# Altium project CB_REV_C.PrjPcb
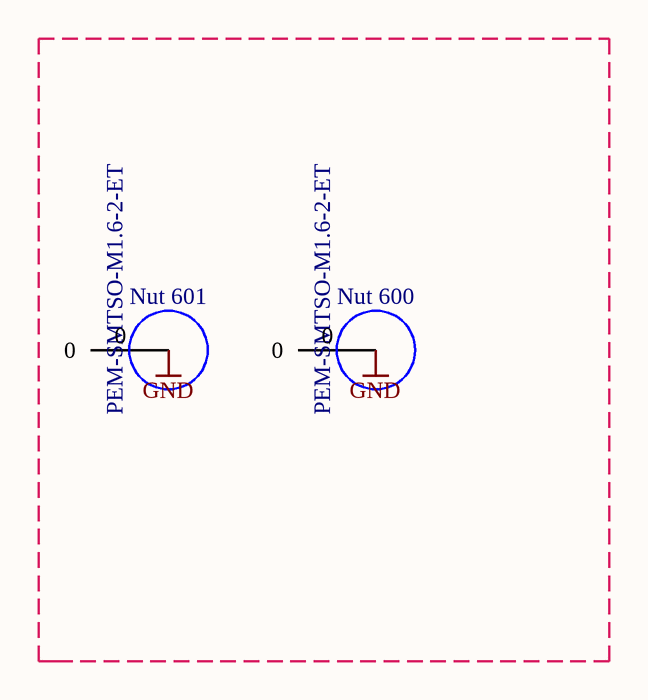
[diagram p0: FULL_CB_INTEL_REV_C.SchDoc]
4 sheets, 21 parts. Net scope: global (net labels, ports and power ports of the same name join across sheets).
Board file: FULL_CB_REV_C.PcbDoc
Sheets:
  FULL_CB_INTEL_REV_C.SchDoc
  FULL_CB_Plugs_REV_C.SchDoc
  FULL_CB_Power_REV_C.SchDoc
  FULL_CB_Servo_REV_C.SchDoc

## Sheet FULL_CB_INTEL_REV_C.SchDoc
size A4; DrawnBy: Philip Rowse

### Parts
Nut_600  PEM-SMTSO-M1.6-2-ET  [PEM-SMTSO-M1.6-2-ET]
Nut_601  PEM-SMTSO-M1.6-2-ET  [PEM-SMTSO-M1.6-2-ET]

### Nets
GND: Nut_600.0 Nut_601.0

### Notes on the sheet
- Title:
- Date:
- Time:
- https://creativecommons.org/publicdomain/zero/1.0/
- Sheet:
- Approved:
- of:
- Drawn By:
- Checked By:
- ProfiCNC

### Library data of the parts
Nut_600 Nut_601 = PEM-SMTSO-M1.6-2-ET: Fastener, M1.6x0.35mm, 8.00MM Pitch, SMTSO, CS; Mfg Part Num (Alternate): Check; Manufacturer 1: PennEngineering; Supplier Part Number 1: PEM-SMTSO-M1.6-2-ET; Supplier 1: PennEngineering; Manufacturer Part Number 1: PEM-SMTSO-M1.6-2-ET; Supplier Unit Price 1: 0.7

## Sheet FULL_CB_Plugs_REV_C.SchDoc
size A4; DrawnBy: Philip Rowse
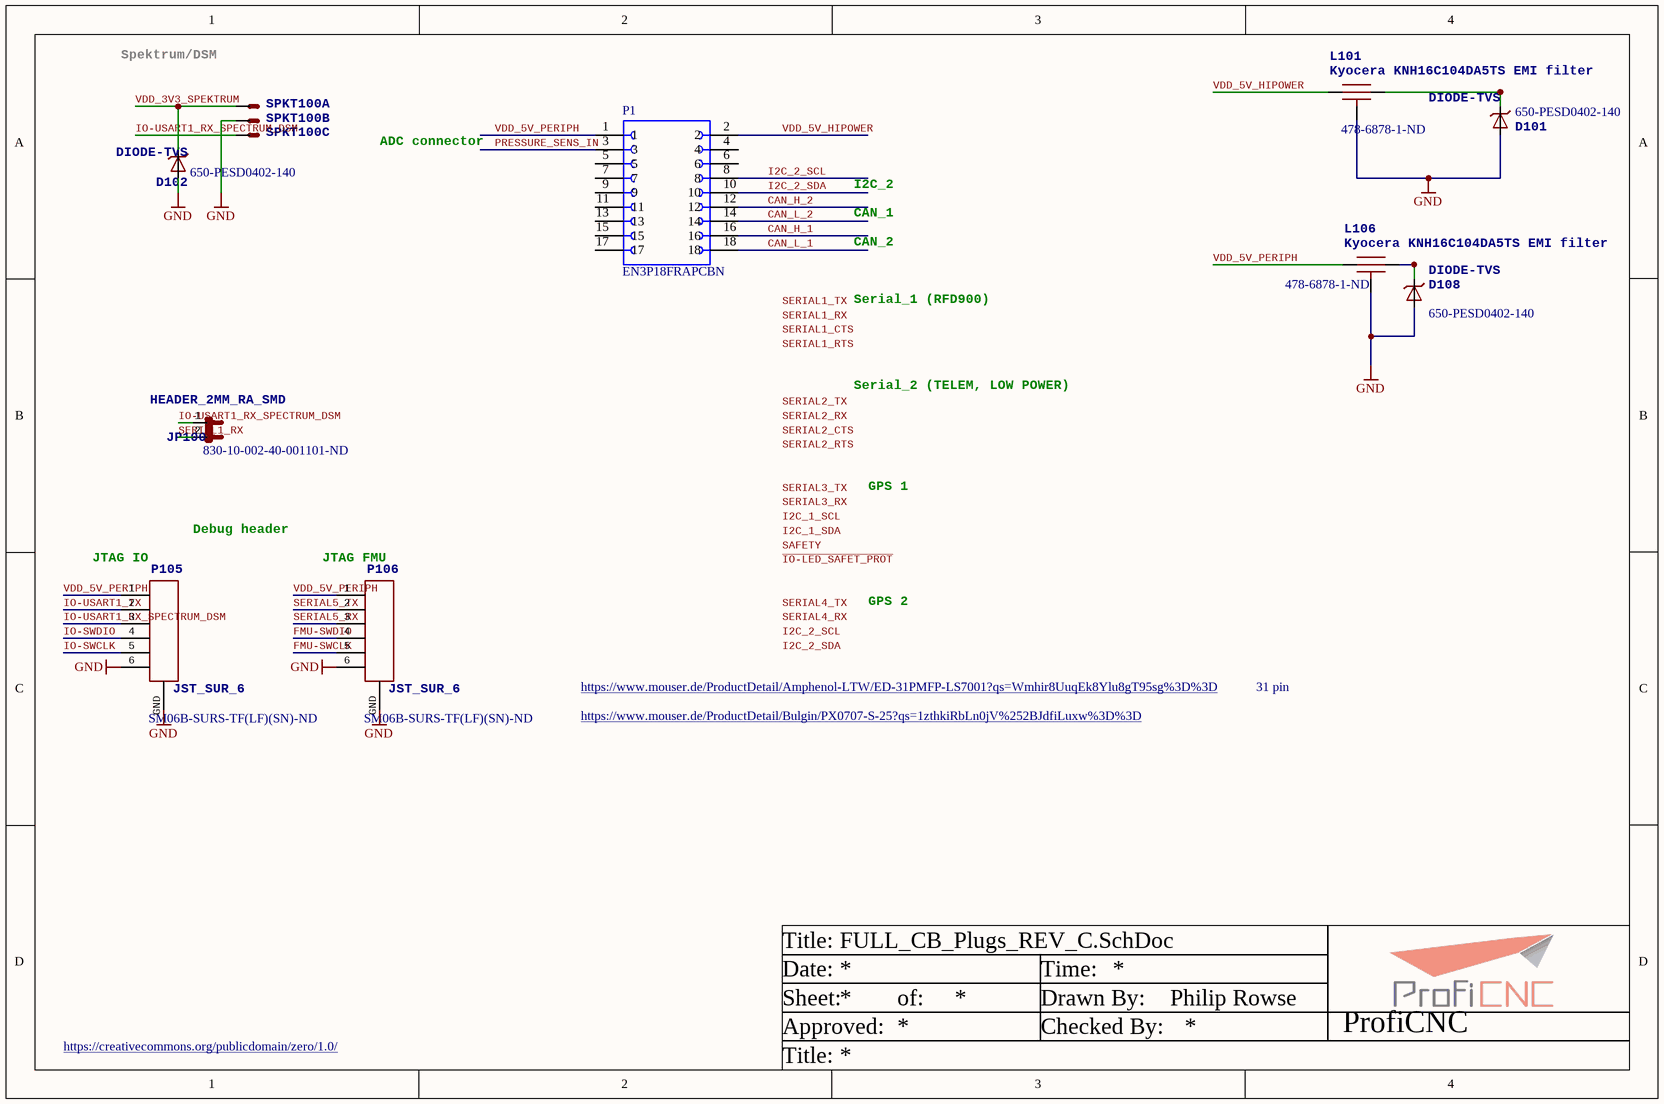
[diagram p1: FULL_CB_Plugs_REV_C.SchDoc]

### Parts
D101  DIODE-TVS  Supplier Part Number 1: 650-PESD0402-140  [0402-TVS]
D102  DIODE-TVS  Supplier Part Number 1: 650-PESD0402-140  [0402-TVS]
D108  DIODE-TVS  Supplier Part Number 1: 650-PESD0402-140  [0402-TVS]
JP100  HEADER_2MM_RA_SMD  Supplier Part Number 1: 830-10-002-40-001101-ND  [HEADER_2MM_RA_2]
L101  Kyocera KNH16C104DA5TS EMI filter  Supplier Part Number 1: 478-6878-1-ND  [KYOCERA-KNH16-DA]
L106  Kyocera KNH16C104DA5TS EMI filter  Supplier Part Number 1: 478-6878-1-ND  [KYOCERA-KNH16-DA]
P1  EN3P18FRAPCBN  [SWITCHCRAFT_EN3P18FRAPCBN]
P105  JST_SUR_6  Supplier Part Number 1: SM06B-SURS-TF(LF)(SN)-ND  [JST_SUR_H6]
P106  JST_SUR_6  Supplier Part Number 1: SM06B-SURS-TF(LF)(SN)-ND  [JST_SUR_H6]
SPKT100  CONN_SPEKTRUM_RX-TH  [B3B-ZR]  (value not drawn)  (parts A,B,C of 3)

### Nets
GND: D101.A D102.A D108.A L101.GND L106.GND P105.6 P105.GND P106.6 P106.GND SPKT100.2(S)
CAN_H_1: P1.16
CAN_H_2: P1.12
CAN_L_1: P1.18
CAN_L_2: P1.14
FMU-SWCLK: P106.5
FMU-SWDIO: P106.4
I2C_2_SCL: P1.8
I2C_2_SDA: P1.10
IO-SWCLK: P105.5
IO-SWDIO: P105.4
IO-USART1_RX_SPECTRUM_DSM: JP100.1 P105.3 SPKT100.1(S)
IO-USART1_TX: P105.2
PRESSURE_SENS_IN: P1.3
SERIAL1_RX: JP100.2
SERIAL5_RX: P106.3
SERIAL5_TX: P106.2
VDD_3V3_SPEKTRUM: D102.C SPKT100.3(S)
VDD_5V_HIPOWER: L101.P$1 P1.2
VDD_5V_PERIPH: L106.P$1 P1.1 P105.1 P106.1
NetD101_C: D101.C L101.P$2
NetD108_C: D108.C L106.P$2

Not connected (* = marked no-connect by the designer): P1 4 5 6 7 9 11 13 15 17

### Notes on the sheet
- Spektrum/DSM
- ADC connector
- I2C_2
- CAN_1
- CAN_2
- Serial_1 (RFD900)
- Serial_2 (TELEM, LOW POWER)
- Debug header
- GPS 1
- (near P105) JTAG IO
- (near P106) JTAG FMU
- GPS 2
- https://www.mouser.de/ProductDetail/Amphenol-LTW/ED-31PMFP-LS7001?qs=Wmhir8UuqEk8Ylu8gT95sg%3D%3D
- 31 pin
- https://www.mouser.de/ProductDetail/Bulgin/PX0707-S-25?qs=1zthkiRbLn0jV%252BJdfiLuxw%3D%3D
- Labels drawn without touching a wire or pin: I2C_1_SCL, I2C_1_SDA, I2C_2_SCL, I2C_2_SDA, SAFETY, SERIAL1_CTS, SERIAL1_RTS, SERIAL1_RX, SERIAL1_TX, SERIAL2_CTS, SERIAL2_RTS, SERIAL2_RX, SERIAL2_TX, SERIAL3_RX, SERIAL3_TX, SERIAL4_RX, SERIAL4_TX, ~{IO-LED_SAFET_PROT}
- Title:
- Date:
- Time:
- https://creativecommons.org/publicdomain/zero/1.0/
- Sheet:
- Approved:
- of:
- Drawn By:
- Checked By:
- ProfiCNC

### Library data of the parts
D101 D102 D108 = DIODE-TVS: Diode, TVS, 14VWM, 40VC, 0402, SMD; Supplier 1: Mouser
JP100 = HEADER_2MM_RA_SMD: Connector, PCB, 2MM, 2Pos, R/A, SMD, Au; Supplier 1: Digi-Key
L101 L106 = KNH16C104DA5TS: Capacitor, Filter, 0.1uF, 25V, 2A, 0603, SMD; Supplier 1: Digi-Key
P105 P106 = JST_SUR_6: Connector, Header, 6Pos, .8mm IDC, R/A, SMD, Tin; Supplier 1: Digi-Key
SPKT100 = CONN_SPEKTRUM_RX-TH: Spektrum RX connector; JST ZH series S3B-ZR-SM4A-TF; PARTNO: B3B-ZR(LF)(SN)
P1 = EN3P18FRAPCBN: Package: None; Price: None; Value: *; MP: EN3P18FRAPCBN; Availability: Unavailable

## Sheet FULL_CB_Power_REV_C.SchDoc
size A4; DrawnBy: Philip Rowse
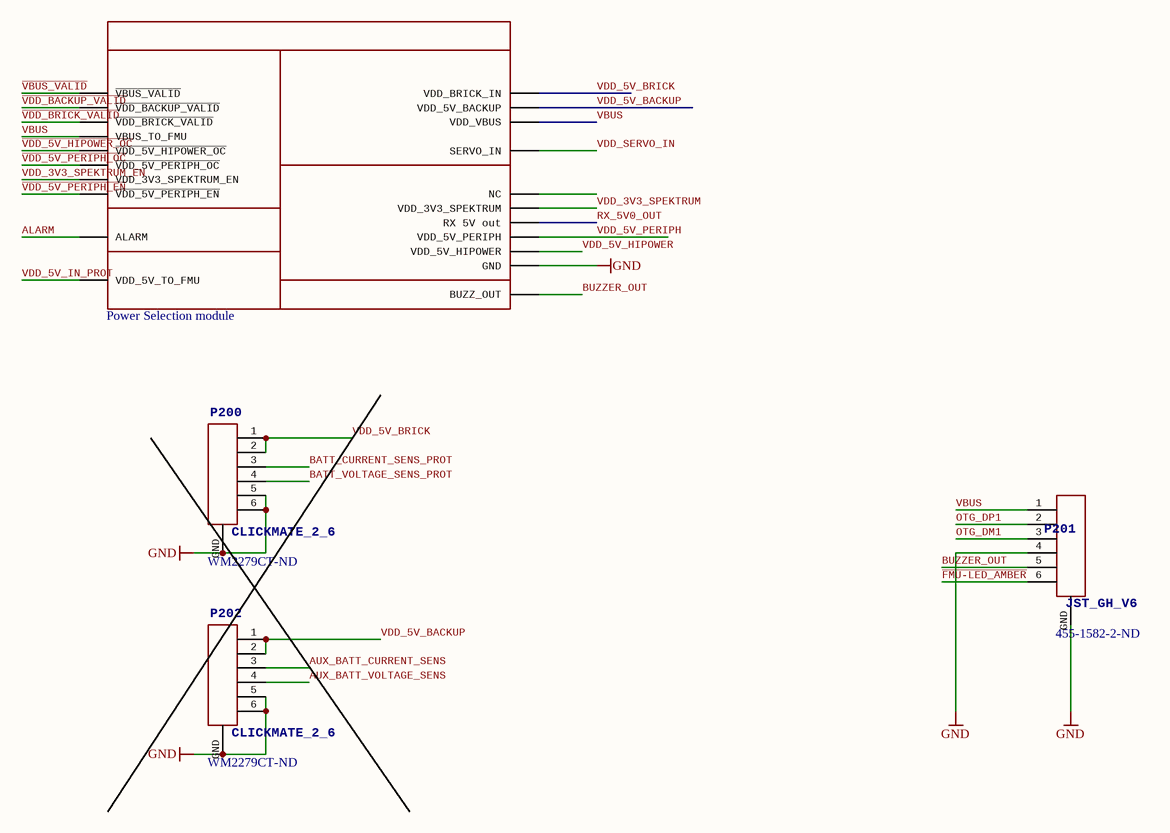
[diagram p2: FULL_CB_Power_REV_C.SchDoc]

### Parts
P200  CLICKMATE_2_6  Supplier Part Number 1: WM2279CT-ND  [CLICKMATE_V6_2MM]
P201  JST_GH_V6  Supplier Part Number 1: 455-1582-2-ND  [JST_GH_V6]
P202  CLICKMATE_2_6  Supplier Part Number 1: WM2279CT-ND  [CLICKMATE_V6_2MM]
PSM200  Power Selection module  [PSM]

### Nets
GND: P200.5 P200.6 P200.GND P201.4 P201.GND P202.5 P202.6 P202.GND PSM200.GND
ALARM: PSM200.ALARM
AUX_BATT_CURRENT_SENS: P202.3
AUX_BATT_VOLTAGE_SENS: P202.4
BATT_CURRENT_SENS_PROT: P200.3
BATT_VOLTAGE_SENS_PROT: P200.4
BUZZER_OUT: P201.5 PSM200.BUZZER_OUT(BUZZ_OUT)
~{FMU-LED_AMBER}: P201.6
OTG_DM1: P201.3
OTG_DP1: P201.2
RX_5V0_OUT: PSM200.RX(RX_5V_out)
~{VBUS_VALID}: PSM200.!VBUS_VALID(~{VBUS_VALID})
~{VDD_5V_HIPOWER_OC}: PSM200.!VDD_5V_HIPOWER_OC(~{VDD_5V_HIPOWER_OC})
~{VDD_5V_PERIPH_EN}: PSM200.!VDD_5V_PERIPH_EN(~{VDD_5V_PERIPH_EN})
~{VDD_5V_PERIPH_OC}: PSM200.!VDD_5V_PERIPH_OC(~{VDD_5V_PERIPH_OC})
~{VDD_BACKUP_VALID}: PSM200.!VDD_BACKUP_VALID(~{VDD_BACKUP_VALID})
~{VDD_BRICK_VALID}: PSM200.!VDD_BRICK_VALID(~{VDD_BRICK_VALID})
VBUS: P201.1 PSM200.VBUS(VBUS_TO_FMU) PSM200.VDD_VBUS
VDD_3V3_SPEKTRUM: PSM200.SPEK(VDD_3V3_SPEKTRUM)
VDD_3V3_SPEKTRUM_EN: PSM200.VDD_3V3_SPEKTRUM_EN
VDD_5V_BACKUP: P202.1 P202.2 PSM200.VDD_5V_BACKUP
VDD_5V_BRICK: P200.1 P200.2 PSM200.VDD_BRICK_IN
VDD_5V_HIPOWER: PSM200.5V_HIPOWER(VDD_5V_HIPOWER)
VDD_5V_IN_PROT: PSM200.VDD_5V_IN_PROT(VDD_5V_TO_FMU)
VDD_5V_PERIPH: PSM200.5V_PERIPH(VDD_5V_PERIPH)
VDD_SERVO_IN: PSM200.SERVO_IN

Not connected (* = marked no-connect by the designer): PSM200 NC

### Notes on the sheet
- Title:
- Date:
- Time:
- https://creativecommons.org/publicdomain/zero/1.0/
- Sheet:
- Approved:
- of:
- Drawn By:
- Checked By:
- ProfiCNC

### Library data of the parts
P200 P202 = CLICKMATE_2_6: Connector, Header, 6Pos, 2.54MM, Vert, THT, Au; Supplier 1: Digi-Key
P201 = JST_GH_V6: BM06B-GHS-TBT; Supplier 1: Digi-Key
PSM200 = PSMPSM: PCA, PSM, Assembly

## Sheet FULL_CB_Servo_REV_C.SchDoc
size A4; DrawnBy: Philip Rowse
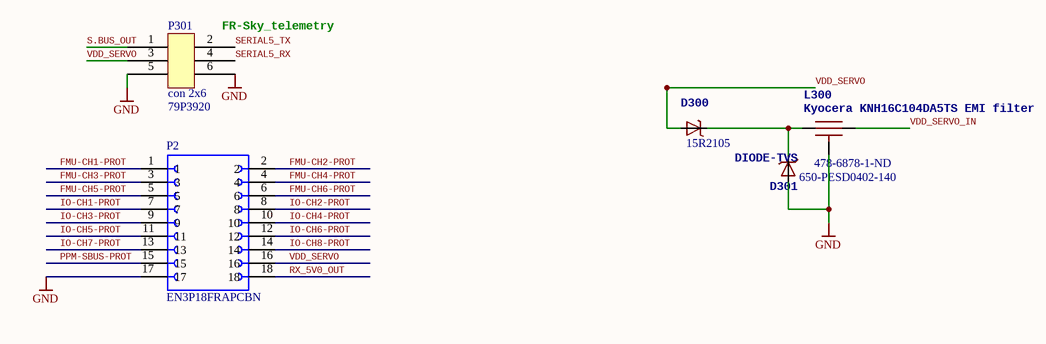
[diagram p3: FULL_CB_Servo_REV_C.SchDoc]

### Parts
D300  Supplier Part Number 1: 15R2105  [MICROSMP]  (hidden comment: MSS1P4-M3)
D301  DIODE-TVS  Supplier Part Number 1: 650-PESD0402-140  [0402-TVS]
L300  Kyocera KNH16C104DA5TS EMI filter  Supplier Part Number 1: 478-6878-1-ND  [KYOCERA-KNH16-DA]
P2  EN3P18FRAPCBN  [SWITCHCRAFT_EN3P18FRAPCBN]
P301  con 2x6  Supplier Part Number 1: 79P3920  [TSW-103-07-G-D]

### Nets
GND: D301.A L300.GND P2.17 P301.5 P301.6
FMU-CH1-PROT: P2.1
FMU-CH2-PROT: P2.2
FMU-CH3-PROT: P2.3
FMU-CH4-PROT: P2.4
FMU-CH5-PROT: P2.5
FMU-CH6-PROT: P2.6
IO-CH1-PROT: P2.7
IO-CH2-PROT: P2.8
IO-CH3-PROT: P2.9
IO-CH4-PROT: P2.10
IO-CH5-PROT: P2.11
IO-CH6-PROT: P2.12
IO-CH7-PROT: P2.13
IO-CH8-PROT: P2.14
PPM-SBUS-PROT: P2.15
RX_5V0_OUT: P2.18
S.BUS_OUT: P301.1
SERIAL5_RX: P301.4
SERIAL5_TX: P301.2
VDD_SERVO: D300.ANODE(A) P2.16 P301.3
VDD_SERVO_IN: L300.P$2
NetD300_CATHODE: D300.CATHODE(C) D301.C L300.P$1

### Notes on the sheet
- (near P301) FR-Sky_telemetry
- Title
- Size:
- Date:
- A4
- Number:
- Time:
- Revision:
- Sheet
- of
- File:

### Library data of the parts
D300 = DIODE-SCHOTTKY_MSMP: Diode, Schottky, 40V, 1A, MicroSMP, SMD; Supplier 1: Newark
D301 = DIODE-TVS: Diode, TVS, 14VWM, 40VC, 0402, SMD; Supplier 1: Mouser
L300 = KNH16C104DA5TS: as L101 on sheet FULL_CB_Plugs_REV_C; Supplier 1: Digi-Key
P301 = con 2x6: Connector, Header, 6Pos, 2.54MM, Vert, THT, Au; Supplier 1: Newark
P2 = EN3P18FRAPCBN: Package: None; Price: None; Value: *; MP: EN3P18FRAPCBN; Availability: Unavailable

## Nets that join several sheets
GND: FULL_CB_INTEL_REV_C (Nut_600.0 Nut_601.0), FULL_CB_Plugs_REV_C (10 pins), FULL_CB_Power_REV_C (9 pins), FULL_CB_Servo_REV_C (5 pins)
RX_5V0_OUT: FULL_CB_Power_REV_C (PSM200.RX), FULL_CB_Servo_REV_C (P2.18)
SERIAL5_RX: FULL_CB_Plugs_REV_C (P106.3), FULL_CB_Servo_REV_C (P301.4)
SERIAL5_TX: FULL_CB_Plugs_REV_C (P106.2), FULL_CB_Servo_REV_C (P301.2)
VDD_3V3_SPEKTRUM: FULL_CB_Plugs_REV_C (D102.C SPKT100.3), FULL_CB_Power_REV_C (PSM200.SPEK)
VDD_5V_HIPOWER: FULL_CB_Plugs_REV_C (L101.P$1 P1.2), FULL_CB_Power_REV_C (PSM200.5V_HIPOWER)
VDD_5V_PERIPH: FULL_CB_Plugs_REV_C (L106.P$1 P1.1 P105.1 P106.1), FULL_CB_Power_REV_C (PSM200.5V_PERIPH)
VDD_SERVO_IN: FULL_CB_Power_REV_C (PSM200.SERVO_IN), FULL_CB_Servo_REV_C (L300.P$2)